# Altium schematic sheet System.SchDoc
size A; SheetNumber: 1; SheetTotal: 5
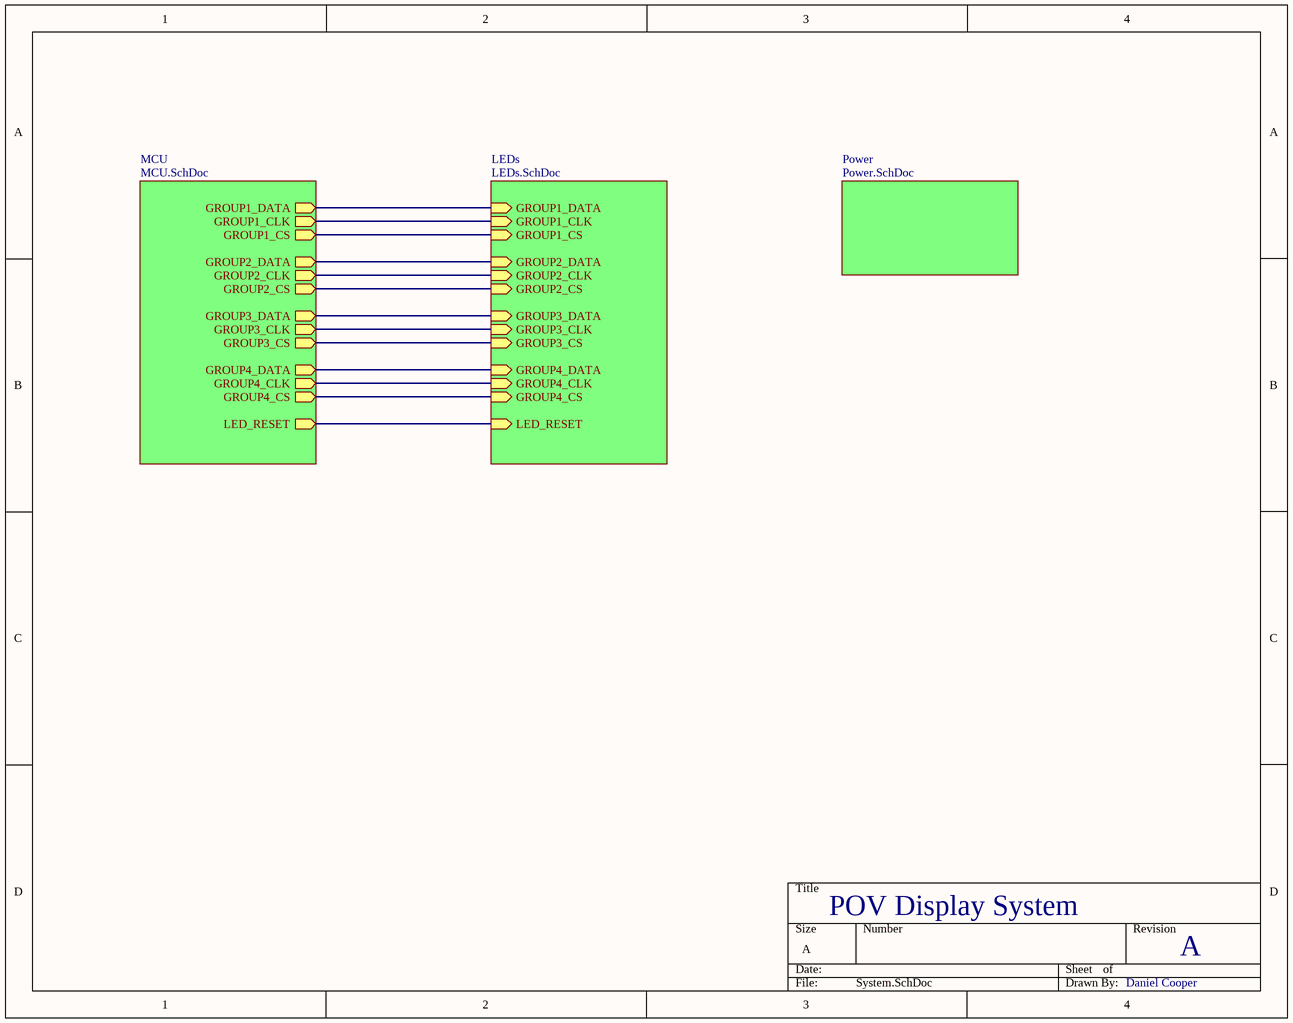
[diagram p0: System.SchDoc]

## Sub-sheets
LEDs = LEDs.SchDoc: LED_RESET (in), GROUP4_CS (in), GROUP4_CLK (in), GROUP4_DATA (in), GROUP3_CS (in), GROUP3_CLK (in), GROUP3_DATA (in), GROUP2_CS (in), GROUP2_CLK (in), GROUP2_DATA (in), GROUP1_CS (in), GROUP1_CLK (in), GROUP1_DATA (in)
MCU = MCU.SchDoc: GROUP1_DATA (out), GROUP1_CLK (out), GROUP1_CS (out), GROUP2_DATA (out), GROUP2_CLK (out), GROUP2_CS (out), GROUP3_DATA (out), GROUP3_CLK (out), GROUP3_CS (out), GROUP4_DATA (out), GROUP4_CLK (out), GROUP4_CS (out), LED_RESET (out)
Power = Power.SchDoc: no entries

## Nets
(unnamed): sheet MCU/GROUP1_DATA, sheet LEDs/GROUP1_DATA
(unnamed): sheet MCU/GROUP1_CLK, sheet LEDs/GROUP1_CLK
(unnamed): sheet MCU/GROUP1_CS, sheet LEDs/GROUP1_CS
(unnamed): sheet MCU/GROUP2_DATA, sheet LEDs/GROUP2_DATA
(unnamed): sheet MCU/GROUP2_CLK, sheet LEDs/GROUP2_CLK
(unnamed): sheet MCU/GROUP2_CS, sheet LEDs/GROUP2_CS
(unnamed): sheet MCU/GROUP3_DATA, sheet LEDs/GROUP3_DATA
(unnamed): sheet MCU/GROUP3_CLK, sheet LEDs/GROUP3_CLK
(unnamed): sheet MCU/GROUP3_CS, sheet LEDs/GROUP3_CS
(unnamed): sheet MCU/GROUP4_DATA, sheet LEDs/GROUP4_DATA
(unnamed): sheet MCU/GROUP4_CLK, sheet LEDs/GROUP4_CLK
(unnamed): sheet MCU/GROUP4_CS, sheet LEDs/GROUP4_CS
(unnamed): sheet MCU/LED_RESET, sheet LEDs/LED_RESET

## Notes on the sheet
- POV Display System
- A
- Daniel Cooper